# EAGLE schematic PCM5102a_FG_Small (EAGLE 7.2.0)
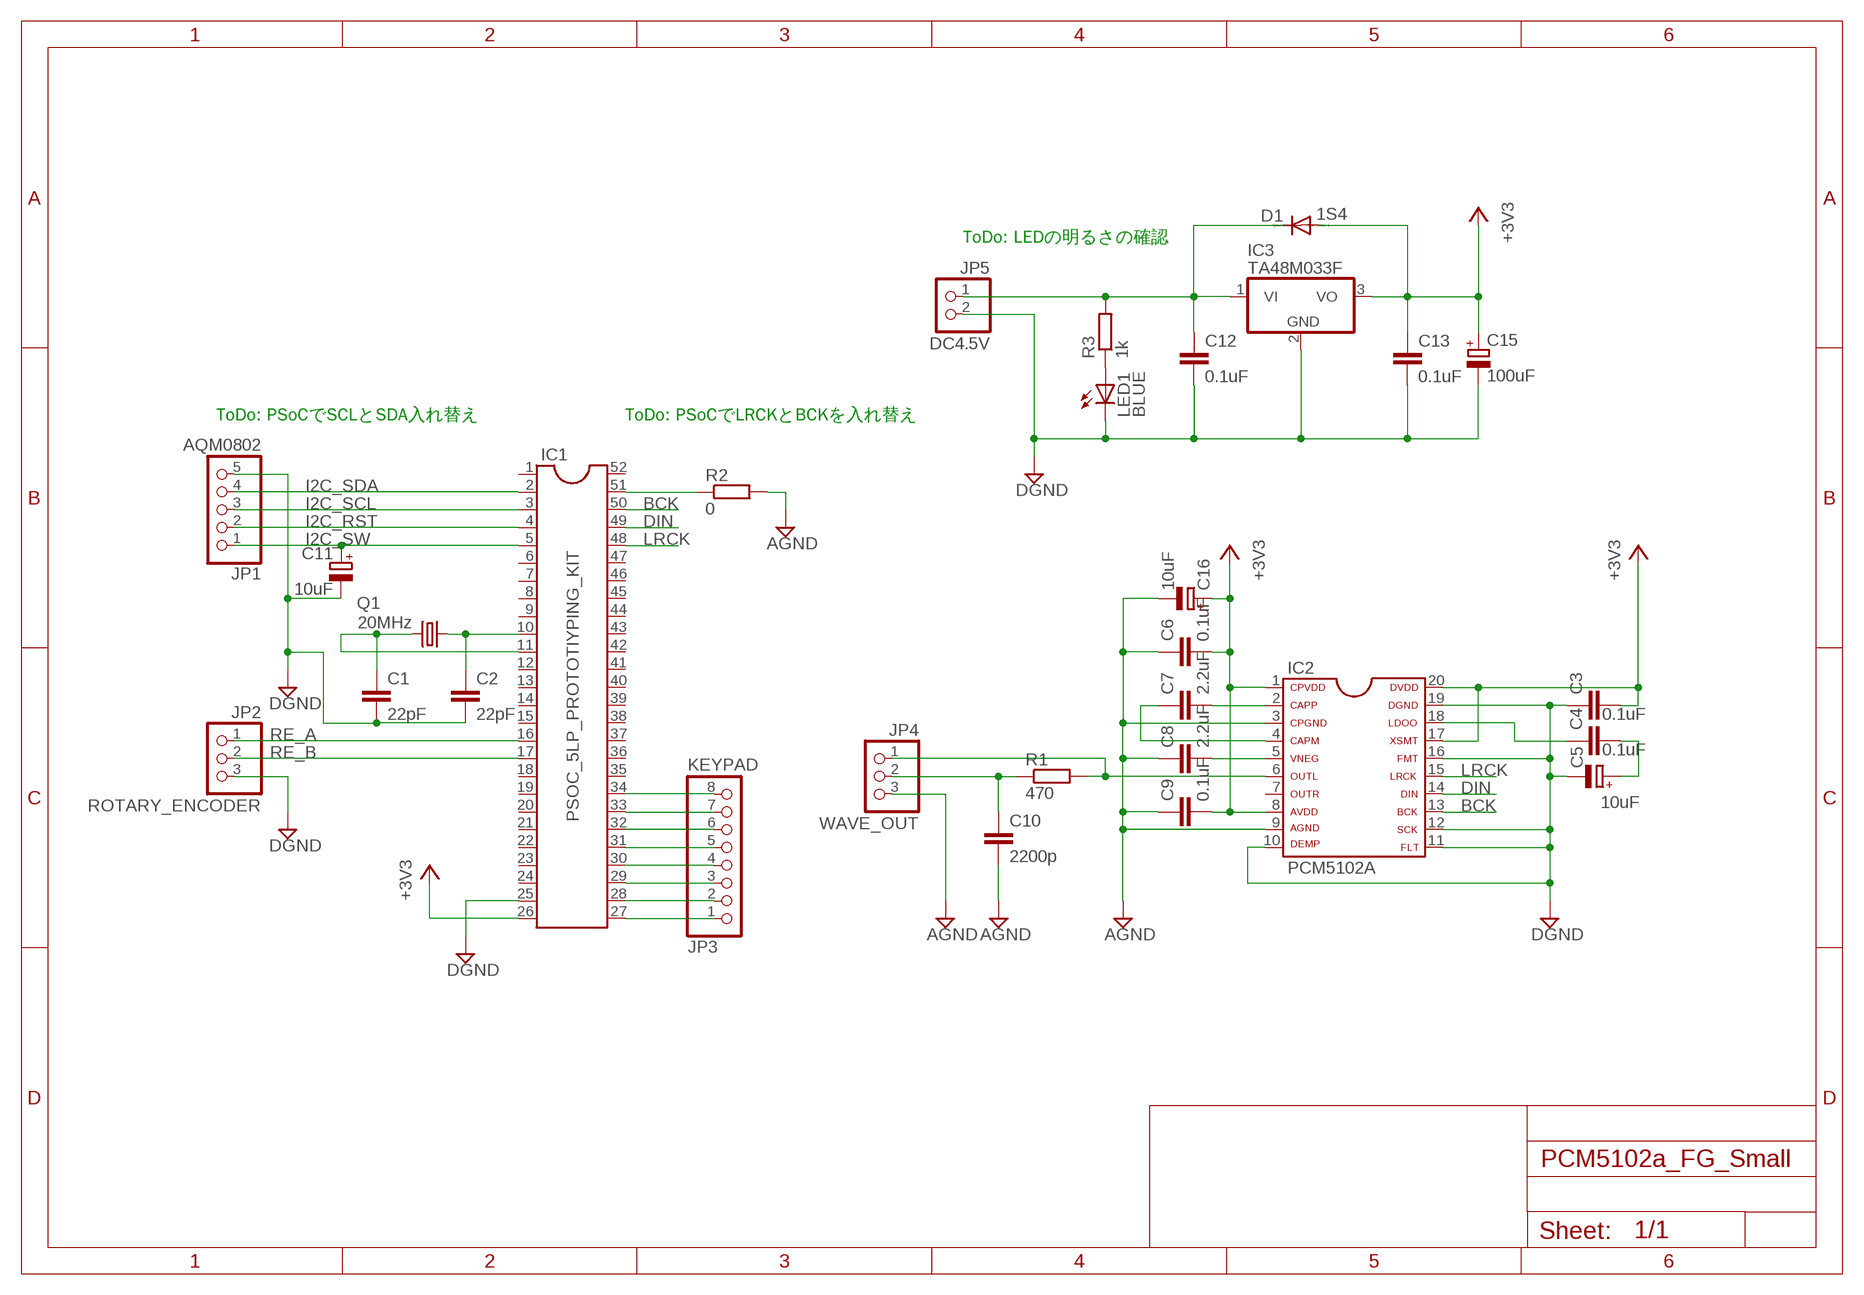
[diagram p0: schematic, sheet 1]

## Parts
C1  22pF  C-EU025-024X044  [C025-024X044]
C2  22pF  C-EU025-024X044  [C025-024X044]
C3  0.1uF  C-EU025-024X044  [C025-024X044]
C4  0.1uF  C-EU025-024X044  [C025-024X044]
C5  10uF  CPOL-EUE2.5-5  [E2,5-5]
C6  0.1uF  C-EU025-024X044  [C025-024X044]
C7  2.2uF  C-EU075-063X106  [C075-063X106]
C8  2.2uF  C-EU075-063X106  [C075-063X106]
C9  0.1uF  C-EU025-024X044  [C025-024X044]
C10  2200p  C-EU050-035X075  [C050-035X075]
C11  10uF  CPOL-EUE2.5-5  [E2,5-5]
C12  0.1uF  C-EU025-024X044  [C025-024X044]
C13  0.1uF  C-EU025-024X044  [C025-024X044]
C15  100uF  CPOL-EUE2.5-7  [E2,5-7]
C16  10uF  CPOL-EUE2.5-5  [E2,5-5]
D1  1S4  1N4004  [DO41-10]
IC1  PSOC_5LP_PROTOTIYPING_KIT  [DIL52-8]
IC2  PCM5102A  [DIL20-6]
IC3  TA48M033F  7805TV  [TO220V]
JP1  AQM0802  PINHD-1X5  [1X05]
JP2  ROTARY_ENCODER  PINHD-1X3  [1X03]
JP3  KEYPAD  PINHD-1X8  [1X08]
JP4  WAVE_OUT  PINHD-1X3  [1X03]
JP5  DC4.5V  PINHD-1X2  [1X02]
LED1  BLUE  LED3MM  [LED3MM]
Q1  20MHz  CRYSTALHC49S  [HC49/S]
R1  470  R-EU_0207/7  [0207/7]
R2  0  R-EU_0207/7  [0207/7]
R3  1k  R-EU_0207/7  [0207/7]

## Nets
+3V3: C3.2 C6.2 C9.2 C13.1 C15.+ C16.+ D1.A IC1.26 IC2.1 IC2.8 IC2.17 IC2.20 IC3.3(VO)
AGND: C6.1 C8.1 C9.1 C10.2 C16.- IC2.3 IC2.9 JP4.3 R2.2
BCK: IC1.50 IC2.13
DC4.5V: C12.1 D1.C IC3.1(VI) JP5.1 R3.2
DGND: C1.2 C2.2 C3.1 C5.- C11.- C12.2 C13.2 C15.- IC1.25 IC2.10 IC2.11 IC2.12 IC2.16 IC2.19 IC3.2(GND) JP1.5 JP2.3 JP5.2 LED1.K(C)
DIN: IC1.49 IC2.14
I2C_RST: IC1.4 JP1.2
I2C_SCL: IC1.3 JP1.3
I2C_SDA: IC1.2 JP1.4
I2C_SW: C11.+ IC1.5 JP1.1
LRCK: IC1.48 IC2.15
N$1: C4.1 IC2.18
N$2: C4.2 C5.+
N$3: C7.2 IC2.2
N$4: C7.1 IC2.4
N$5: C8.2 IC2.5
N$6: IC2.6 JP4.1 R1.2
N$7: C10.1 JP4.2 R1.1
N$8: IC1.27 JP3.1
N$9: IC1.28 JP3.2
N$10: IC1.29 JP3.3
N$11: IC1.30 JP3.4
N$12: IC1.31 JP3.5
N$13: IC1.32 JP3.6
N$14: IC1.33 JP3.7
N$15: IC1.34 JP3.8
N$16: C2.1 IC1.10 Q1.1
N$17: C1.1 IC1.11 Q1.2
N$18: IC1.51 R2.1
N$20: LED1.A R3.1
RE_A: IC1.16 JP2.1
RE_B: IC1.17 JP2.2
Unconnected: IC1.1 IC1.6 IC1.7 IC1.8 IC1.9 IC1.12 IC1.13 IC1.14 IC1.15 IC1.18 IC1.19 IC1.20 IC1.21 IC1.22 IC1.23 IC1.24 IC1.35 IC1.36 IC1.37 IC1.38 IC1.39 IC1.40 IC1.41 IC1.42 IC1.43 IC1.44 IC1.45 IC1.46 IC1.47 IC1.52 IC2.7

## Notes on the sheet
- ToDo: LEDの明るさの確認
- ToDo: PSoCでSCLとSDA入れ替え | ToDo: PSoCでLRCKとBCKを入れ替え

## Library data of the parts
C1-C4 C6-C10 C12 C13 = rcl:C-EU: CAPACITOR, European symbol
C5 C11 C15 C16 = rcl:CPOL-EU: POLARIZED CAPACITOR, European symbol
D1 = diode:1N4004: DIODE general purpose rectifier, 1 A
IC1 = mylib2:PSOC_5LP_PROTOTIYPING_KIT: PSoC 5LP Prototyping Kit
IC2 = mylib2:PCM5102A: PCM5102A
IC3 = linear:78*: Positive VOLTAGE REGULATOR Source: http://cache.national.com/ds/LM/LM78L05.pdf http://www.fairchildsemi.com/ds/LM/LM7805.pdf
JP1 = pinhead:PINHD-1X5: PIN HEADER
JP2 JP4 = pinhead:PINHD-1X3: PIN HEADER
JP3 = pinhead:PINHD-1X8: PIN HEADER
JP5 = pinhead:PINHD-1X2: PIN HEADER
LED1 = led:LED: LED OSRAM: - CHIPLED LG R971, LG N971, LY N971, LG Q971, LY Q971, LO R971, LY R971 LH N974, LH R974 LS Q976, LO Q976, LY Q976 LO Q996 - Hyper CHIPLED LW Q18S LB Q993, LB Q99A, LB R99A - SideLED LS A670, LO A670, LY A670, LG A670, LP A670 LB A673, LV A673, LT A673, LW A673 LH A674 LY A675 LS A676, LA A676, LO A676, LY A676, LW A676 LS A679, LY A679, LG A679 - Hyper Micro SIDELED® LS Y876, LA Y876, LO Y876, LY Y876 LT Y87S - SmartLED LW L88C, LW L88S LB L89C, LB L89S, LG L890 LS L89K, LO L89K, LY L89K LS L896, LA L896, LO L896, LY L896 - TOPLED LS T670, LO T670, LY T670, LG T670, LP T670 LSG T670, LSP T670, LSY T670, LOP T670, LYG T670 LG T671, LOG T671, LSG T671 LB T673, LV T673, LT T673, LW T673 LH T674 LS T676, LA T676, LO T676, LY T676, LB T676, LH T676, LSB T676, LW T676 LB T67C, LV T67C, LT T67C, LS T67K, LO T67K, LY T67K, LW E67C LS E67B, LA E67B, LO E67B, LY E67B, LB E67C, LV E67C, LT E67C LW T67C LS T679, LY T679, LG T679 LS T770, LO T770, LY T770, LG T770, LP T770 LB T773, LV T773, LT T773, LW T773 LH T774 LS E675, LA E675, LY E675, LS T675 LS T776, LA T776, LO T776, LY T776, LB T776 LHGB T686 LT T68C, LB T68C - Hyper Mini TOPLED® LB M676 - Mini TOPLED Santana® LG M470 LS M47K, LO M47K, LY M47K Source: http://www.osram.convergy.de LUXEON: - LUMILED® LXK2-PW12-R00, LXK2-PW12-S00, LXK2-PW14-U00, LXK2-PW14-V00 LXK2-PM12-R00, LXK2-PM12-S00, LXK2-PM14-U00 LXK2-PE12-Q00, LXK2-PE12-R00, LXK2-PE12-S00, LXK2-PE14-T00, LXK2-PE14-U00 LXK2-PB12-K00, LXK2-PB12-L00, LXK2-PB12-M00, LXK2-PB14-N00, LXK2-PB14-P00, LXK2-PB14-Q00 LXK2-PR12-L00, LXK2-PR12-M00, LXK2-PR14-Q00, LXK2-PR14-R00 LXK2-PD12-Q00, LXK2-PD12-R00, LXK2-PD12-S00 LXK2-PH12-R00, LXK2-PH12-S00 LXK2-PL12-P00, LXK2-PL12-Q00, LXK2-PL12-R00 Source: www.luxeon.com KINGBRIGHT: KA-3528ASYC Source: www.kingbright.com
Q1 = crystal:CRYSTAL: CRYSTAL; OC_FARNELL: 1667008; OC_NEWARK: unknown
R1 = rcl:R-EU_: RESISTOR, European symbol
R2 R3 = resistor:R-EU_: RESISTOR, European symbol